# Altium schematic sheet Front_Connector.SchDoc
size A4; CompanyName: Technische Hochschule Nürnberg Georg Simon Ohm; Organization: UltraZohm; Address1: Kesslerplatz 12; Address2: 90489 Nürnberg; Address3: GERMANY; DocumentNumber: 3; SheetNumber: 3; SheetTotal: 5; Website: www.ultrazohm.com
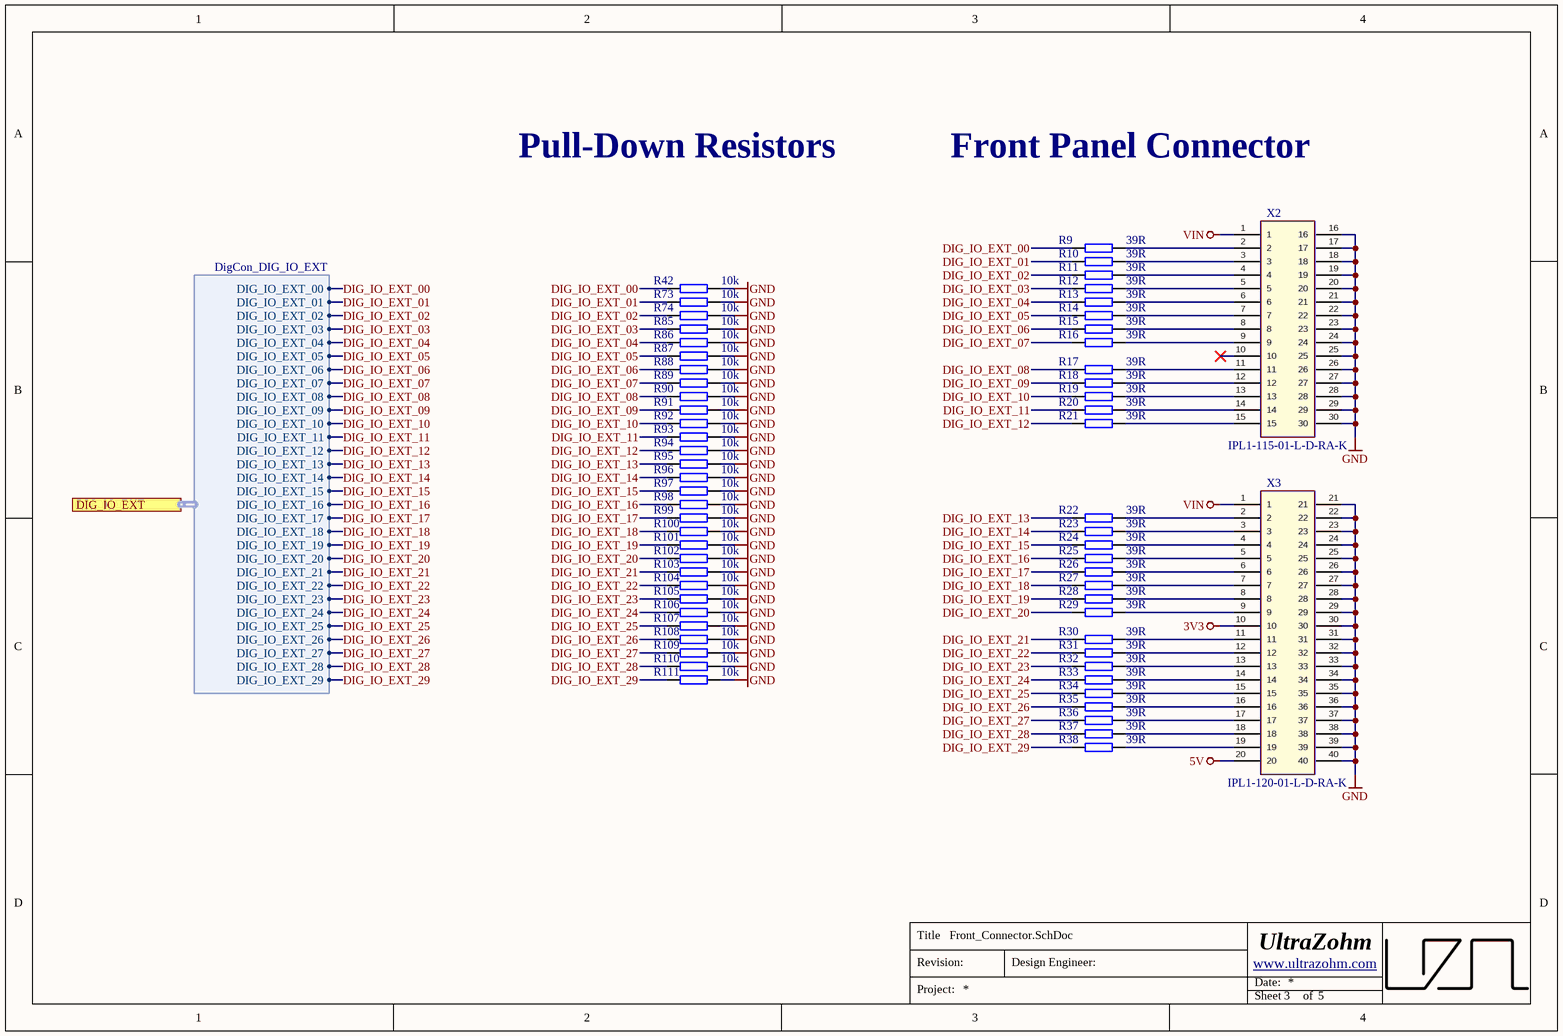
[diagram p0: Front_Connector.SchDoc]

## Parts
R9  39R  [R_0603_TE]
R10  39R  [R_0603_TE]
R11  39R  [R_0603_TE]
R12  39R  [R_0603_TE]
R13  39R  [R_0603_TE]
R14  39R  [R_0603_TE]
R15  39R  [R_0603_TE]
R16  39R  [R_0603_TE]
R17  39R  [R_0603_TE]
R18  39R  [R_0603_TE]
R19  39R  [R_0603_TE]
R20  39R  [R_0603_TE]
R21  39R  [R_0603_TE]
R22  39R  [R_0603_TE]
R23  39R  [R_0603_TE]
R24  39R  [R_0603_TE]
R25  39R  [R_0603_TE]
R26  39R  [R_0603_TE]
R27  39R  [R_0603_TE]
R28  39R  [R_0603_TE]
R29  39R  [R_0603_TE]
R30  39R  [R_0603_TE]
R31  39R  [R_0603_TE]
R32  39R  [R_0603_TE]
R33  39R  [R_0603_TE]
R34  39R  [R_0603_TE]
R35  39R  [R_0603_TE]
R36  39R  [R_0603_TE]
R37  39R  [R_0603_TE]
R38  39R  [R_0603_TE]
R42  10k  [R_0603_TE]
R73  10k  [R_0603_TE]
R74  10k  [R_0603_TE]
R85  10k  [R_0603_TE]
R86  10k  [R_0603_TE]
R87  10k  [R_0603_TE]
R88  10k  [R_0603_TE]
R89  10k  [R_0603_TE]
R90  10k  [R_0603_TE]
R91  10k  [R_0603_TE]
R92  10k  [R_0603_TE]
R93  10k  [R_0603_TE]
R94  10k  [R_0603_TE]
R95  10k  [R_0603_TE]
R96  10k  [R_0603_TE]
R97  10k  [R_0603_TE]
R98  10k  [R_0603_TE]
R99  10k  [R_0603_TE]
R100  10k  [R_0603_TE]
R101  10k  [R_0603_TE]
R102  10k  [R_0603_TE]
R103  10k  [R_0603_TE]
R104  10k  [R_0603_TE]
R105  10k  [R_0603_TE]
R106  10k  [R_0603_TE]
R107  10k  [R_0603_TE]
R108  10k  [R_0603_TE]
R109  10k  [R_0603_TE]
R110  10k  [R_0603_TE]
R111  10k  [R_0603_TE]
X2  IPL1-115-01-L-D-RA-K  [IPL1-115-01-XX-D-RA]
X3  IPL1-120-01-L-D-RA-K  [IPL1-120-01-XX-D-RA]

## Ports
DIG_IO_EXT (harness DigCon_DIG_IO_EXT)

## Harnesses
DigCon_DIG_IO_EXT: DIG_IO_EXT_00, DIG_IO_EXT_01, DIG_IO_EXT_02, DIG_IO_EXT_03, DIG_IO_EXT_04, DIG_IO_EXT_05, DIG_IO_EXT_06, DIG_IO_EXT_07, DIG_IO_EXT_08, DIG_IO_EXT_09, DIG_IO_EXT_10, DIG_IO_EXT_11, DIG_IO_EXT_12, DIG_IO_EXT_13, DIG_IO_EXT_14, DIG_IO_EXT_15, DIG_IO_EXT_16, DIG_IO_EXT_17, DIG_IO_EXT_18, DIG_IO_EXT_19, DIG_IO_EXT_20, DIG_IO_EXT_21, DIG_IO_EXT_22, DIG_IO_EXT_23, DIG_IO_EXT_24, DIG_IO_EXT_25, DIG_IO_EXT_26, DIG_IO_EXT_27, DIG_IO_EXT_28, DIG_IO_EXT_29

## Nets
3V3: X3.10
5V: X3.20
GND: R42.2 R73.2 R74.2 R85.2 R86.2 R87.2 R88.2 R89.2 R90.2 R91.2 R92.2 R93.2 R94.2 R95.2 R96.2 R97.2 R98.2 R99.2 R100.2 R101.2 R102.2 R103.2 R104.2 R105.2 R106.2 R107.2 R108.2 R109.2 R110.2 R111.2 X2.16 X2.17 X2.18 X2.19 X2.20 X2.21 X2.22 X2.23 X2.24 X2.25 X2.26 X2.27 X2.28 X2.29 X2.30 X3.21 X3.22 X3.23 X3.24 X3.25 X3.26 X3.27 X3.28 X3.29 X3.30 X3.31 X3.32 X3.33 X3.34 X3.35 X3.36 X3.37 X3.38 X3.39 X3.40
VIN: X2.1 X3.1
DIG_IO_EXT_00: R9.1 R42.1 ; port DIG_IO_EXT.DIG_IO_EXT_00
DIG_IO_EXT_01: R10.1 R73.1 ; port DIG_IO_EXT.DIG_IO_EXT_01
DIG_IO_EXT_02: R11.1 R74.1 ; port DIG_IO_EXT.DIG_IO_EXT_02
DIG_IO_EXT_03: R12.1 R85.1 ; port DIG_IO_EXT.DIG_IO_EXT_03
DIG_IO_EXT_04: R13.1 R86.1 ; port DIG_IO_EXT.DIG_IO_EXT_04
DIG_IO_EXT_05: R14.1 R87.1 ; port DIG_IO_EXT.DIG_IO_EXT_05
DIG_IO_EXT_06: R15.1 R88.1 ; port DIG_IO_EXT.DIG_IO_EXT_06
DIG_IO_EXT_07: R16.1 R89.1 ; port DIG_IO_EXT.DIG_IO_EXT_07
DIG_IO_EXT_08: R17.1 R90.1 ; port DIG_IO_EXT.DIG_IO_EXT_08
DIG_IO_EXT_09: R18.1 R91.1 ; port DIG_IO_EXT.DIG_IO_EXT_09
DIG_IO_EXT_10: R19.1 R92.1 ; port DIG_IO_EXT.DIG_IO_EXT_10
DIG_IO_EXT_11: R20.1 R93.1 ; port DIG_IO_EXT.DIG_IO_EXT_11
DIG_IO_EXT_12: R21.1 R94.1 ; port DIG_IO_EXT.DIG_IO_EXT_12
DIG_IO_EXT_13: R22.1 R95.1 ; port DIG_IO_EXT.DIG_IO_EXT_13
DIG_IO_EXT_14: R23.1 R96.1 ; port DIG_IO_EXT.DIG_IO_EXT_14
DIG_IO_EXT_15: R24.1 R97.1 ; port DIG_IO_EXT.DIG_IO_EXT_15
DIG_IO_EXT_16: R25.1 R98.1 ; port DIG_IO_EXT.DIG_IO_EXT_16
DIG_IO_EXT_17: R26.1 R99.1 ; port DIG_IO_EXT.DIG_IO_EXT_17
DIG_IO_EXT_18: R27.1 R100.1 ; port DIG_IO_EXT.DIG_IO_EXT_18
DIG_IO_EXT_19: R28.1 R101.1 ; port DIG_IO_EXT.DIG_IO_EXT_19
DIG_IO_EXT_20: R29.1 R102.1 ; port DIG_IO_EXT.DIG_IO_EXT_20
DIG_IO_EXT_21: R30.1 R103.1 ; port DIG_IO_EXT.DIG_IO_EXT_21
DIG_IO_EXT_22: R31.1 R104.1 ; port DIG_IO_EXT.DIG_IO_EXT_22
DIG_IO_EXT_23: R32.1 R105.1 ; port DIG_IO_EXT.DIG_IO_EXT_23
DIG_IO_EXT_24: R33.1 R106.1 ; port DIG_IO_EXT.DIG_IO_EXT_24
DIG_IO_EXT_25: R34.1 R107.1 ; port DIG_IO_EXT.DIG_IO_EXT_25
DIG_IO_EXT_26: R35.1 R108.1 ; port DIG_IO_EXT.DIG_IO_EXT_26
DIG_IO_EXT_27: R36.1 R109.1 ; port DIG_IO_EXT.DIG_IO_EXT_27
DIG_IO_EXT_28: R37.1 R110.1 ; port DIG_IO_EXT.DIG_IO_EXT_28
DIG_IO_EXT_29: R38.1 R111.1 ; port DIG_IO_EXT.DIG_IO_EXT_29
NetR9_2: R9.2 X2.2
NetR10_2: R10.2 X2.3
NetR11_2: R11.2 X2.4
NetR12_2: R12.2 X2.5
NetR13_2: R13.2 X2.6
NetR14_2: R14.2 X2.7
NetR15_2: R15.2 X2.8
NetR16_2: R16.2 X2.9
NetR17_2: R17.2 X2.11
NetR18_2: R18.2 X2.12
NetR19_2: R19.2 X2.13
NetR20_2: R20.2 X2.14
NetR21_2: R21.2 X2.15
NetR22_2: R22.2 X3.2
NetR23_2: R23.2 X3.3
NetR24_2: R24.2 X3.4
NetR25_2: R25.2 X3.5
NetR26_2: R26.2 X3.6
NetR27_2: R27.2 X3.7
NetR28_2: R28.2 X3.8
NetR29_2: R29.2 X3.9
NetR30_2: R30.2 X3.11
NetR31_2: R31.2 X3.12
NetR32_2: R32.2 X3.13
NetR33_2: R33.2 X3.14
NetR34_2: R34.2 X3.15
NetR35_2: R35.2 X3.16
NetR36_2: R36.2 X3.17
NetR37_2: R37.2 X3.18
NetR38_2: R38.2 X3.19

Not connected (* = marked no-connect by the designer): X2 10*

## Notes on the sheet
- Pull-Down Resistors
- Front Panel Connector
- Title
- Revision:
- Design Engineer:
- Date:
- Project:
- Sheet
- of

## Library data of the parts
R9-R38 = UZgen_R_0603_39R: Generic resistor; Manufacturer: UZgen; Tolerance: 1 %; Created from: UZgenTool; Manufacturer Part Number: UZgen_R_0603_39R; PartID: 187; Created On: 02.07.2024 17:29:48; Device Package: 0603; Last Updated: 02.07.2024 17:29:48; Mounting Type: SMD; Value: 39R
R42 R73 R74 R85-R111 = UZgen_R_0603_10k: Generic resistor; Manufacturer: UZgen; Tolerance: 1 %; Created from: AGeiger; Manufacturer Part Number: UZgen_R_0603_10k; PartID: 1; Created On: 02.07.2024 14:34:53; Value: 10k; Device Package: 0603; Mounting Type: SMD; Last Updated: 02.07.2024 14:37:16
X2 = IPL1-115-01-L-D-RA-K: Terminal Assembly, Double Row, Right Angle, Thru-Hole, 2.54 mm x 2.54 mm Pitch, 30 Pins; Manufacturer: SAMTEC; Created from: TWendt; Number of positions: 30; Manufacturer Part Number: IPL1-115-01-L-D-RA-K; PartID: 34; Created On: 12.02.2021 15:31:18; ComponentLink1Description: Homepage; ComponentLink1URL: https://www.samtec.com/products/ipl1; Component Type: Samtec Connector; Device Package: Connector; Last Updated: 15.02.2021 10:07:42; Supplier 1: SAMTEC; Supplier Part Number 1: IPL1-115-01-L-D-RA-K; Type: Connector; Live Cycle Status: 1; Number of rows: 2; Stock number: not stored
X3 = IPL1-120-01-L-D-RA-K: Terminal Assembly, Double Row, Right Angle, Thru-Hole, 2.54 mm x 2.54 mm Pitch, 40 Pins; Manufacturer: SAMTEC; Created from: TWendt; Number of positions: 40; Manufacturer Part Number: IPL1-120-01-L-D-RA-K; PartID: 33; Created On: 12.02.2021 15:26:11; ComponentLink1Description: Homepage; ComponentLink1URL: https://www.samtec.com/products/ipl1; Component Type: Samtec Connector; Device Package: Connector; Last Updated: 15.02.2021 10:07:42; Mounting Type: THT; Supplier 1: SAMTEC; Supplier Part Number 1: IPL1-120-01-L-D-RA-K; Type: Connector; Live Cycle Status: 1; Number of rows: 2; Stock number: not stored